# EAGLE schematic halfBridge v9 (EAGLE 9.7.0)
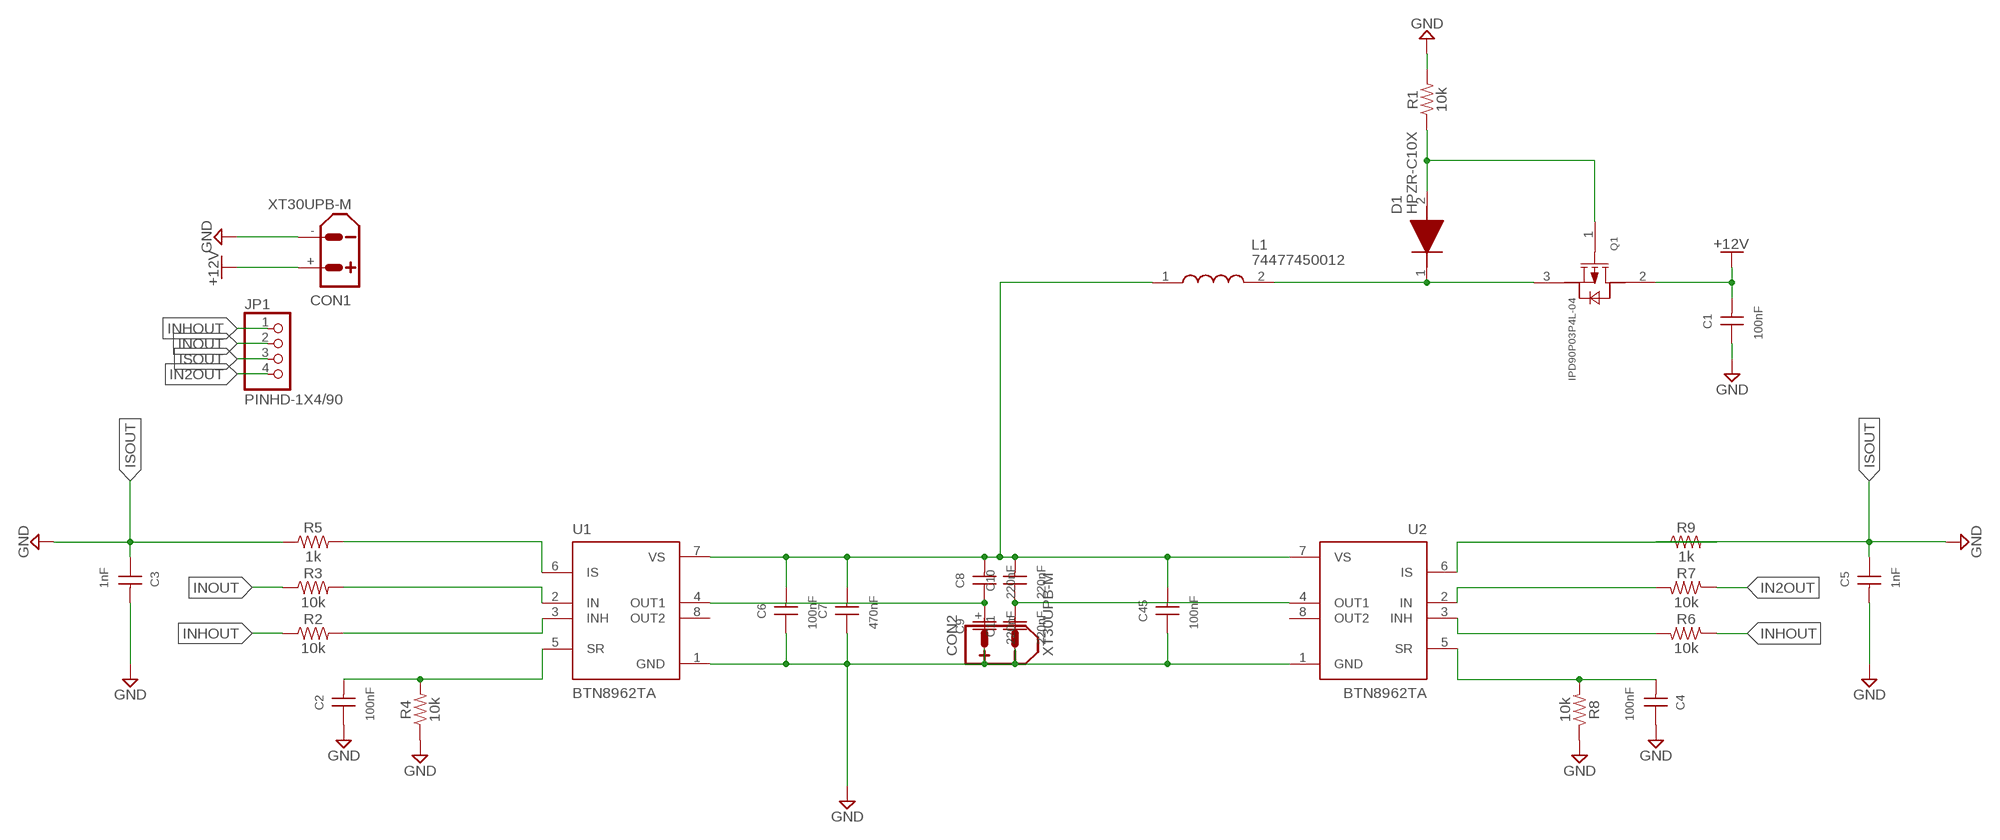
[diagram p0: schematic, sheet 1]

## Parts
C1  100nF  WCAP-CSGP_0603_FI0.35_885012206126_50V(DC)_W  [WCAP-CSGP_0603_FI0.35_W]
C2  100nF  WCAP-CSGP_0603_FI0.35_885012206126_50V(DC)_W  [WCAP-CSGP_0603_FI0.35_W]
C3  1nF  WCAP-CSGP_0603_FI0.35_885012206126_50V(DC)_W  [WCAP-CSGP_0603_FI0.35_W]
C4  100nF  WCAP-CSGP_0603_FI0.35_885012206126_50V(DC)_W  [WCAP-CSGP_0603_FI0.35_W]
C5  1nF  WCAP-CSGP_0603_FI0.35_885012206126_50V(DC)_W  [WCAP-CSGP_0603_FI0.35_W]
C6  100nF  WCAP-CSGP_0603_FI0.35_885012206126_50V(DC)_W  [WCAP-CSGP_0603_FI0.35_W]
C7  470nF  WCAP-CSGP_0603_FI0.35_885012206126_50V(DC)_W  [WCAP-CSGP_0603_FI0.35_W]
C8  220nF  WCAP-CSGP_0603_FI0.35_885012206126_50V(DC)_W  [WCAP-CSGP_0603_FI0.35_W]
C9  220nF  WCAP-CSGP_0603_FI0.35_885012206126_50V(DC)_W  [WCAP-CSGP_0603_FI0.35_W]
C10  220nF  WCAP-CSGP_0603_FI0.35_885012206126_50V(DC)_W  [WCAP-CSGP_0603_FI0.35_W]
C11  220nF  WCAP-CSGP_0603_FI0.35_885012206126_50V(DC)_W  [WCAP-CSGP_0603_FI0.35_W]
C45  100nF  WCAP-CSGP_0603_885012006073_100V(DC)_W  [WCAP-CSGP_0603_W]
CON1  XT30UPB-M  [XT30UPB-M]
CON2  XT30UPB-M  [XT30UPB-M]
D1  HPZR-C10X  [HPZRC10X]
JP1  PINHD-1X4/90  [1X04/90]
L1  74477450012  [WE-PD2_5848/582055]
Q1  IPD90P03P4L-04  [TO228P998X235-3N-2-V]
R1  10k  10KOHM-0603-1/10W-1%  [0603]
R2  10k  10KOHM-0603-1/10W-1%  [0603]
R3  10k  10KOHM-0603-1/10W-1%  [0603]
R4  10k  10KOHM-0603-1/10W-1%  [0603]
R5  1k  1KOHM-0603-1/10W-1%  [0603]
R6  10k  10KOHM-0603-1/10W-1%  [0603]
R7  10k  10KOHM-0603-1/10W-1%  [0603]
R8  10k  10KOHM-0603-1/10W-1%  [0603]
R9  1k  1KOHM-0603-1/10W-1%  [0603]
U1  BTN8962TA  [TO127P1500X440-8N-1]
U2  BTN8962TA  [TO127P1500X440-8N-1]

## Nets
+12V: C1.2 CON1.+ Q1.2(DRAIN)
GND: C1.1 C2.1 C3.2 C4.1 C5.2 C6.1 C7.1 C9.1 C11.1 C45.1 CON1.- R1.2 R4.1 R8.1 U1.1(GND) U2.1(GND)
IN2OUT: JP1.4 R7.1
INHOUT: JP1.1 R2.1 R6.1
INOUT: JP1.2 R3.1
ISOUT: C3.1 C5.1 JP1.3 R5.1 R9.1 ; supply symbol labelled GND
N$1: C6.2 C7.2 C8.2 C10.2 C45.2 L1.1 U1.7(VS) U2.7(VS)
N$2: D1.1(K) L1.2 Q1.3(SOURCE)
N$3: D1.2(A) Q1.1(GATE) R1.1
N$4: R2.2 U1.3(INH)
N$5: R3.2 U1.2(IN)
N$6: C2.2 R4.2 U1.5(SR)
N$7: R5.2 U1.6(IS)
N$8: R6.2 U2.3(INH)
N$9: R7.2 U2.2(IN)
N$10: C4.2 R8.2 U2.5(SR)
N$11: R9.2 U2.6(IS)
N$12: C8.1 C9.2 CON2.+ U1.4(OUT1)
N$13: C10.1 C11.2 CON2.- U2.4(OUT1)
Unconnected: U1.8(OUT2) U2.8(OUT2)

## Library data of the parts
C1-C11 = Wurth_Capacitors_WCAP-CSGP:WCAP-CSGP_0603_FI0.35: WCAP-CSGP MLCCs 0603 General Purpose Characteristics General purpose product series High performance ceramic High electrical precision and stability ceramic especially for NP0 Minimal aging especially for NP0 Mounting style: SMT-Chip Ceramic: NP0 (Class I), X5R (Class II), X7R (Class II) Temperature coefficient: ±30 ppm/°C; ±0.54 % for NP0 ±15 % for X5R and X7R Operating temperature: -55 °C up to + 125 °C for NP0 and X7R -55 °C up to + 85 °C for X5R Termination: Cu/Ni/Sn Recommended soldering: Reflow soldering Wave soldering for size 0603 Wave soldering for size 0805 (only valid for the thickness ≤0.85 mm) Applications Temperature compensation (NP0) Coupling Decoupling Bypass Smoothing Filtering Resonant circuit <https://www.we-online.com/catalog/media/o177837v209%20MLCC_GRP_all.jpg> Details see: https://www.we-online.com/catalog/en/pbs/capacitors/multilayer_ceramic_chip_capacitors/mlcc_general_purpose Updated by Ella Wu 2022-12-26 2022(C) Würth Elektronik; CERAMIC-TYPE: X7R Class II; DATASHEET-URL: https://www.we-online.com/redexpert/spec/885012206126?ae; DF: 10%; HEIGHT: 0.8mm; MOUNT: SMT; OPERATING-TEMPERATURE: -55 up to +125 °C; PART-NUMBER: 885012206126; RISO: 0.5GOhm; SIZE: 0603; TECHNICAL-REFERENCE: X7R0603105K050DFCT10000; VALUE: 1uF; VR: 50V(DC)
C45 = Wurth_Capacitors_WCAP-CSGP:WCAP-CSGP_0603: WCAP-CSGP MLCCs 0603 General Purpose Characteristics General purpose product series High performance ceramic High electrical precision and stability ceramic especially for NP0 Minimal aging especially for NP0 Mounting style: SMT-Chip Ceramic: NP0 (Class I), X5R (Class II), X7R (Class II) Temperature coefficient: ±30 ppm/°C; ±0.54 % for NP0 ±15 % for X5R and X7R Operating temperature: -55 °C up to + 125 °C for NP0 and X7R -55 °C up to + 85 °C for X5R Termination: Cu/Ni/Sn Recommended soldering: Reflow soldering Wave soldering for size 0603 Wave soldering for size 0805 (only valid for the thickness ≤0.85 mm) Applications Temperature compensation (NP0) Coupling Decoupling Bypass Smoothing Filtering Resonant circuit <https://www.we-online.com/catalog/media/o177837v209%20MLCC_GRP_all.jpg> Details see: https://www.we-online.com/catalog/en/pbs/capacitors/multilayer_ceramic_chip_capacitors/mlcc_general_purpose Updated by Ella Wu 2022-06-20 2022(C) Würth Elektronik; CERAMIC-TYPE: NP0 Class I; DATASHEET-URL: https://www.we-online.com/redexpert/spec/885012006073?ae; DF: -; HEIGHT: 0.8mm; MOUNT: SMT; OPERATING-TEMPERATURE: -55 up to +125 °C; PART-NUMBER: 885012006073; QMIN: 400+20C; RISO: 10GOhm; SIZE: 0603; TECHNICAL-REFERENCE: NP00603100J100DFCT10000; VALUE: 10pF; VR: 100V(DC)
CON1 CON2 = amass:XT30: AMASS XT30 connector Store in Japan AMASS XT30 connector <https://szc.jp/ams-xt30>
D1 = HPZR-C10X:HPZR-C10X: vp_HPZR_SER - High power voltage regulator diodes@en-us Source: Datasheet <https://assets.nexperia.com/documents/data-sheet/HPZR_SER.pdf>; DESCRIPTION: vp_HPZR_SER - High power voltage regulator diodes@en-us; HEIGHT: 1.1mm; MANUFACTURER_NAME: Nexperia; MANUFACTURER_PART_NUMBER: HPZR-C10X; MOUSER_PART_NUMBER: 771-HPZR-C10X; MOUSER_PRICE-STOCK: https://www.mouser.co.uk/ProductDetail/Nexperia/HPZR-C10X?qs=By6Nw2ByBD1zlTj7%2FUiJlQ%3D%3D
JP1 = Connector:PINHD-1X4: PIN HEADER; CATEGORY: Headers; DESCRIPTION: Header, Right Angle, 4 Position; MANUFACTURER: Generic; MPN: Generic; OPERATING_TEMPERATURE: Generic; PART_STATUS: Active; PITCH: 0.100" (2.54mm); ROHS_COMPLIANCE: Generic; SERIES: Generic; SUB-CATEGORY: Headers, Male Pins; TYPE: Board to Board or Cable, Unshrouded, Through Hole, Right Angle
L1 = 74477450012:74477450012: Wurth WE-PD2 Series Wire-wound SMD Inductor with a Ferrite Core, 0.12 uH +/-20% 10A Idc Source: Datasheet <http://componentsearchengine.com/Datasheets/3/74477450012.pdf>; DESCRIPTION: Wurth WE-PD2 Series Wire-wound SMD Inductor with a Ferrite Core, 0.12 uH +/-20% 10A Idc; HEIGHT: mm; MANUFACTURER_NAME: Wurth Elektronik; MANUFACTURER_PART_NUMBER: 74477450012; MOUSER_PART_NUMBER: 710-74477450012; MOUSER_PRICE-STOCK: https://www.mouser.co.uk/ProductDetail/Wurth-Elektronik/74477450012?qs=rS3zZhy2AQM1SKuqzwHpOg%3D%3D
Q1 = IPD90P03P4L-04:IPD90P03P4L-04: IPD90P03P4L-04 OptiMOS - P2 Power-Transistor, P-channel-Enhancement mode, VDS -30V TO228P998X235-3N-2-V
R1-R4 R6-R8 = SparkFun-Resistors:10KOHM: 10kΩ resistor A resistor is a passive two-terminal electrical component that implements electrical resistance as a circuit element. Resistors act to reduce current flow, and, at the same time, act to lower voltage levels within circuits. - Wikipedia; PROD_ID: RES-00824
R5 R9 = SparkFun-Resistors:1KOHM: 1kΩ resistor A resistor is a passive two-terminal electrical component that implements electrical resistance as a circuit element. Resistors act to reduce current flow, and, at the same time, act to lower voltage levels within circuits. - Wikipedia; PROD_ID: RES-07856
U1 U2 = BTN8962TA:BTN8962TA: BTN8962TA High Current PN Half Bridge NovalithIC TO127P1500X440-8N-1